# EAGLE design programmerRev2 (EAGLE 5.04)
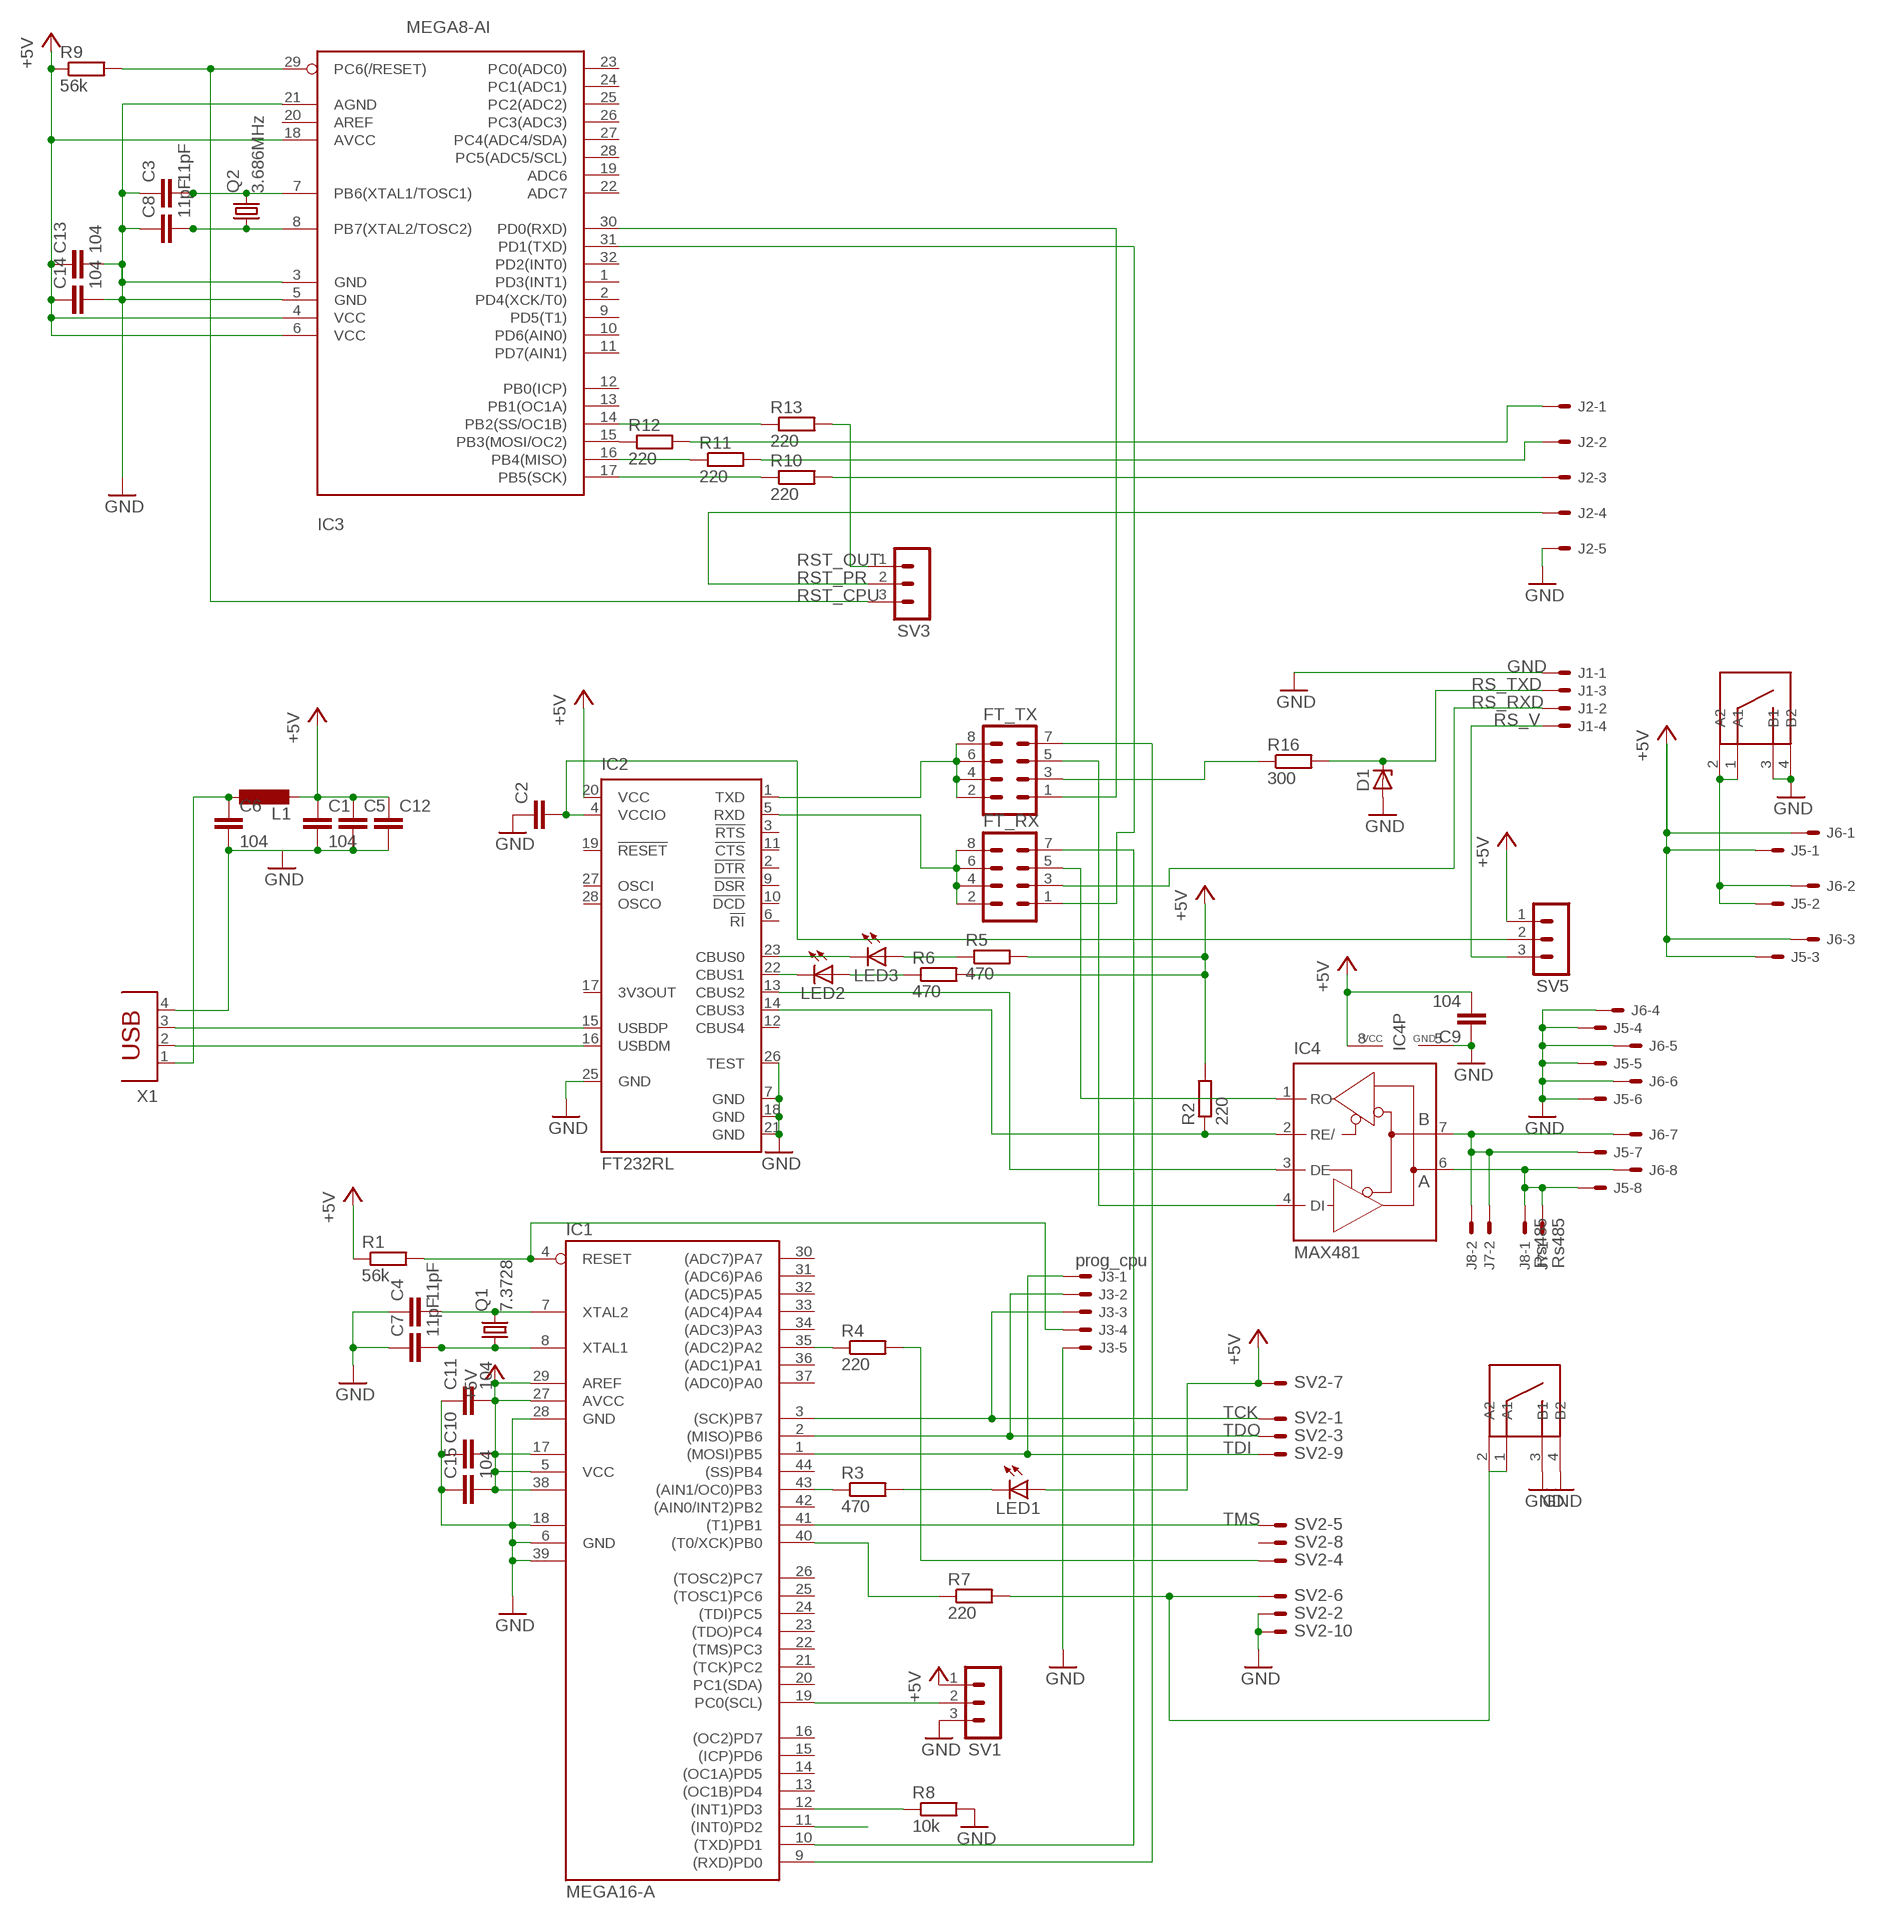
[diagram p0: schematic, sheet 1]

## Parts
C1  104  C-EUC1206  [C1206]
C2  C-EUC1206  [C1206]
C3  11pF  C-EUC1206  [C1206]
C4  11pF  C-EUC1206  [C1206]
C5  C-EUC1206  [C1206]
C6  104  C-EUC1206  [C1206]
C7  11pF  C-EUC1206  [C1206]
C8  11pF  C-EUC1206  [C1206]
C9  104  C-EUC1206  [C1206]
C10  C-EUC1206  [C1206]
C11  104  C-EUC1206  [C1206]
C12  C-EU025-050X050  [C025-050X050]
C13  104  C-EUC1206  [C1206]
C14  104  C-EUC1206  [C1206]
C15  104  C-EUC1206  [C1206]
D1  ZENER-DIODEZD-5  [ZDIO-5]
FT_RX  MA04-2  [MA04-2]
FT_TX  MA04-2  [MA04-2]
IC1  MEGA16-A  [TQFP44]
IC2  FT232RL  [SSOP28]
IC3  MEGA8-AI  [TQFP32-08]
IC4  MAX481  MAX481CSA  [SO08]
J1  22-05-7048-04  [7395-04]
J2  22-05-7058-05  [7395-05]
J3  prog_cpu  22-27-2051-05  [6410-05]
J5  22-05-7088-08  [7395-08]
J6  22-27-2081-08  [6410-08]
J7  Rs485  22-05-7028-02  [7395-02]
J8  Rs485  22-05-7028-02  [7395-02]
L1  L-EUL4532C  [L4532M]
LED1  LEDSMT1206  [1206]
LED2  LEDSMT1206  [1206]
LED3  LEDSMT1206  [1206]
Q1  7.3728  CRYTALHC49S  [HC49/S]
Q2  3.686MHz  CRYTALHC49S  [HC49/S]
R1  56k  R-EU_R1206  [R1206]
R2  220  R-EU_R1206  [R1206]
R3  470  R-EU_R1206  [R1206]
R4  220  R-EU_R1206  [R1206]
R5  470  R-EU_R1206  [R1206]
R6  470  R-EU_R1206  [R1206]
R7  220  R-EU_R1206  [R1206]
R8  10k  R-EU_R1206  [R1206]
R9  56k  R-EU_R1206  [R1206]
R10  220  R-EU_R1206  [R1206]
R11  220  R-EU_R1206  [R1206]
R12  220  R-EU_R1206  [R1206]
R13  220  R-EU_R1206  [R1206]
R16  300  R-EU_R1206  [R1206]
SV1  MA03-1  [MA03-1]
SV2  ML10E  [ML10]
SV3  MA03-1  [MA03-1]
SV5  MA03-1  [MA03-1]
U$1  KL2  [KL2]
U$2  KL2  [KL2]
X1  PN61729  [PN61729]

## Nets
+5V: C1.1 C5.1 C9.2 C10.2 C11.2 C12.1 C13.1 C14.1 C15.2 IC1.5(VCC) IC1.17(VCC1) IC1.27(AVCC) IC1.29(AREF) IC1.38(VCC2) IC2.20(VCC) IC3.4(VCC) IC3.6(VCC) IC3.18(AVCC) IC4.8(VCC) J5.1 J5.3 J6.1 J6.3 L1.2 LED1.A R1.1 R2.2 R5.2 R6.2 R9.1 SV1.1 SV2.7 SV5.1
FT232_V_IN: C2.2 IC2.4(VCCIO) SV5.2
GND: C1.2 C2.1 C3.1 C4.1 C5.2 C6.2 C7.1 C8.1 C9.1 C10.1 C11.1 C12.2 C13.2 C14.2 C15.1 D1.A IC1.6(GND) IC1.18(GND1) IC1.28(GND) IC1.39(GND2) IC2.7(GND) IC2.18(GND) IC2.21(GND) IC2.25(GND) IC2.26(TEST) IC3.3(GND) IC3.5(GND) IC3.21(AGND) IC4.5(GND) J1.1 J2.5 J3.5 J5.4 J5.5 J5.6 J6.4 J6.5 J6.6 R8.2 SV1.3 SV2.2 SV2.10 U$1.3(B1) U$1.4(B2) U$2.3(B1) U$2.4(B2) X1.4
N$1: C3.2 IC3.7(PB6(XTAL1/TOSC1)) Q2.2
N$2: C8.2 IC3.8(PB7(XTAL2/TOSC2)) Q2.1
N$3: FT_TX.3 R16.1
N$4: C6.1 L1.1 X1.1
N$5: C4.2 IC1.7(XTAL2) Q1.2
N$6: IC3.17(PB5(SCK)) R10.1
N$7: C7.2 IC1.8(XTAL1) Q1.1
N$8: IC1.4(RESET) J3.4 R1.2
N$9: FT_TX.7 IC1.9((RXD)PD0)
N$10: FT_RX.7 IC1.10((TXD)PD1)
N$11: R7.2 SV2.6 U$2.1(A1) U$2.2(A2)
N$12: IC1.19(PC0(SCL)) SV1.2
N$13: IC1.12((INT1)PD3) R8.1
N$14: IC4.6(A) J5.8 J6.8 J7.1 J8.1
N$15: IC4.7(B) J5.7 J6.7 J7.2 J8.2
N$16: IC2.14(CBUS3) IC4.2(RE/) R2.1
N$17: IC3.16(PB4(MISO)) R11.1
N$18: J5.2 J6.2 U$1.1(A1) U$1.2(A2)
N$19: FT_RX.5 IC4.1(RO)
N$20: FT_TX.5 IC4.4(DI)
N$21: IC3.15(PB3(MOSI/OC2)) R12.1
N$22: IC2.13(CBUS2) IC4.3(DE)
N$23: J2.3 R10.2
N$24: J2.2 R11.2
N$25: IC1.43((AIN1/OC0)PB3) R3.1
N$26: IC1.40((T0/XCK)PB0) R7.1
N$27: IC1.35((ADC2)PA2) R4.1
N$28: R4.2 SV2.4
N$29: LED1.C R3.2
N$30: J2.1 R12.2
N$31: IC3.14(PB2(SS/OC1B)) R13.1
N$32: LED3.A R5.1
N$33: LED2.A R6.1
N$34: IC2.22(CBUS1) LED2.C
N$35: IC2.23(CBUS0) LED3.C
N$36: IC1.11((INT0)PD2)
PROG_RXD: FT_RX.1 IC3.31(PD1(TXD))
PROG_TXD: FT_TX.1 IC3.30(PD0(RXD))
RS_RXD: FT_RX.3 J1.2
RS_TXD: D1.C J1.3 R16.2
RS_V: J1.4 SV5.3
RST_CPU: IC3.29(PC6(/RESET)) R9.2 SV3.3
RST_OUT: R13.2 SV3.1
RST_PR: J2.4 SV3.2
RXD: FT_RX.2 FT_RX.4 FT_RX.6 FT_RX.8 IC2.5(RXD)
TCK: IC1.3((SCK)PB7) J3.3 SV2.1
TDI: IC1.1((MOSI)PB5) J3.1 SV2.9
TDO: IC1.2((MISO)PB6) J3.2 SV2.3
TMS: IC1.41((T1)PB1) SV2.5
TXD: FT_TX.2 FT_TX.4 FT_TX.6 FT_TX.8 IC2.1(TXD)
USB+: IC2.15(USBDP) X1.3
USB-: IC2.16(USBDM) X1.2
Unconnected: IC1.13((OC1B)PD4) IC1.14((OC1A)PD5) IC1.15((ICP)PD6) IC1.16((OC2)PD7) IC1.20(PC1(SDA)) IC1.21((TCK)PC2) IC1.22((TMS)PC3) IC1.23((TDO)PC4) IC1.24((TDI)PC5) IC1.25((TOSC1)PC6) IC1.26((TOSC2)PC7) IC1.30((ADC7)PA7) IC1.31((ADC6)PA6) IC1.32((ADC5)PA5) IC1.33((ADC4)PA4) IC1.34((ADC3)PA3) IC1.36((ADC1)PA1) IC1.37((ADC0)PA0) IC1.42((AIN0/INT2)PB2) IC1.44((SS)PB4) IC2.2(!DTR) IC2.3(!RTS) IC2.6(!RI) IC2.9(!DSR) IC2.10(!DCD) IC2.11(!CTS) IC2.12(CBUS4) IC2.17(3V3OUT) IC2.19(!RESET) IC2.27(OSCI) IC2.28(OSCO) IC3.1(PD3(INT1)) IC3.2(PD4(XCK/T0)) IC3.9(PD5(T1)) IC3.10(PD6(AIN0)) IC3.11(PD7(AIN1)) IC3.12(PB0(ICP)) IC3.13(PB1(OC1A)) IC3.19(ADC6) IC3.20(AREF) IC3.22(ADC7) IC3.23(PC0(ADC0)) IC3.24(PC1(ADC1)) IC3.25(PC2(ADC2)) IC3.26(PC3(ADC3)) IC3.27(PC4(ADC4/SDA)) IC3.28(PC5(ADC5/SCL)) IC3.32(PD2(INT0)) SV2.8

## Library data of the parts
C1-C15 = rcl:C-EU: CAPACITOR, European symbol
D1 = diode:ZENER-DIODE: Z-Diode
FT_RX FT_TX = con-lstb:MA04-2: PIN HEADER
IC1 = atmel:MEGA16: MICROCONTROLLER 16 Kbytes FLASH 1 kbytes SRAM 512 bytes EEPROM USART 8-channel 10 bit ADC Source: avr.lbr
IC2 = ftdichip:FT232R: Source: http://www.ftdichip.com/Documents/DataSheets/DS_FT232R_v104.pdf
IC3 = atmel:MEGA8: MICROCONTROLLER 8 Kbytes FLASH 1 kbytes SRAM 512 bytes EEPROM USART 6-channel 10 bit ADC 2-channel 8 bit ADC Source: avr.lbr
IC4 = maxim:MAX481CSA: RS485 TRANSEIVER
J1 = con-molex:22-?-04: CONNECTOR wire to board 2.54 mm (.1 inch) pitch header
J2 J3 = con-molex:22-?-05: CONNECTOR wire to board 2.54 mm (.1 inch) pitch header
J5 J6 = con-molex:22-?-08: CONNECTOR wire to board 2.54 mm (.1 inch) pitch header
J7 J8 = con-molex:22-?-02: CONNECTOR wire to board 2.54 mm (.1 inch) pitch header
L1 = rcl:L-EU: INDUCTOR, European symbol
LED1-LED3 = led:LED: LED OSRAM: - CHIPLED LG R971, LG N971, LY N971, LG Q971, LY Q971, LO R971, LY R971 LH N974, LH R974 LS Q976, LO Q976, LY Q976 LO Q996 - Hyper CHIPLED LW Q18S LB Q993, LB Q99A, LB R99A - SideLED LS A670, LO A670, LY A670, LG A670, LP A670 LB A673, LV A673, LT A673, LW A673 LH A674 LY A675 LS A676, LA A676, LO A676, LY A676, LW A676 LS A679, LY A679, LG A679 - Hyper Micro SIDELED® LS Y876, LA Y876, LO Y876, LY Y876 LT Y87S - SmartLED LW L88C, LW L88S LB L89C, LB L89S, LG L890 LS L89K, LO L89K, LY L89K LS L896, LA L896, LO L896, LY L896 - TOPLED LS T670, LO T670, LY T670, LG T670, LP T670 LSG T670, LSP T670, LSY T670, LOP T670, LYG T670 LG T671, LOG T671, LSG T671 LB T673, LV T673, LT T673, LW T673 LH T674 LS T676, LA T676, LO T676, LY T676, LB T676, LH T676, LSB T676, LW T676 LB T67C, LV T67C, LT T67C, LS T67K, LO T67K, LY T67K, LW E67C LS E67B, LA E67B, LO E67B, LY E67B, LB E67C, LV E67C, LT E67C LW T67C LS T679, LY T679, LG T679 LS T770, LO T770, LY T770, LG T770, LP T770 LB T773, LV T773, LT T773, LW T773 LH T774 LS E675, LA E675, LY E675, LS T675 LS T776, LA T776, LO T776, LY T776, LB T776 LHGB T686 LT T68C, LB T68C - Hyper Mini TOPLED® LB M676 - Mini TOPLED Santana® LG M470 LS M47K, LO M47K, LY M47K Source: http://www.osram.convergy.de LUXEON: - LUMILED® LXK2-PW12-R00, LXK2-PW12-S00, LXK2-PW14-U00, LXK2-PW14-V00 LXK2-PM12-R00, LXK2-PM12-S00, LXK2-PM14-U00 LXK2-PE12-Q00, LXK2-PE12-R00, LXK2-PE12-S00, LXK2-PE14-T00, LXK2-PE14-U00 LXK2-PB12-K00, LXK2-PB12-L00, LXK2-PB12-M00, LXK2-PB14-N00, LXK2-PB14-P00, LXK2-PB14-Q00 LXK2-PR12-L00, LXK2-PR12-M00, LXK2-PR14-Q00, LXK2-PR14-R00 LXK2-PD12-Q00, LXK2-PD12-R00, LXK2-PD12-S00 LXK2-PH12-R00, LXK2-PH12-S00 LXK2-PL12-P00, LXK2-PL12-Q00, LXK2-PL12-R00 Source: www.luxeon.com KINGBRIGHT: KA-3528ASYC Source: www.kingbright.com
Q1 Q2 = crystal:CRYTAL: CRYSTAL
R1-R13 R16 = rcl:R-EU_: RESISTOR, European symbol
SV1 SV3 SV5 = con-lstb:MA03-1: PIN HEADER
SV2 = con-ml:ML10E: HARTING
U$1 U$2 = solarium:KL2
X1 = con-berg:PN61729: BERG USB connector

## Board
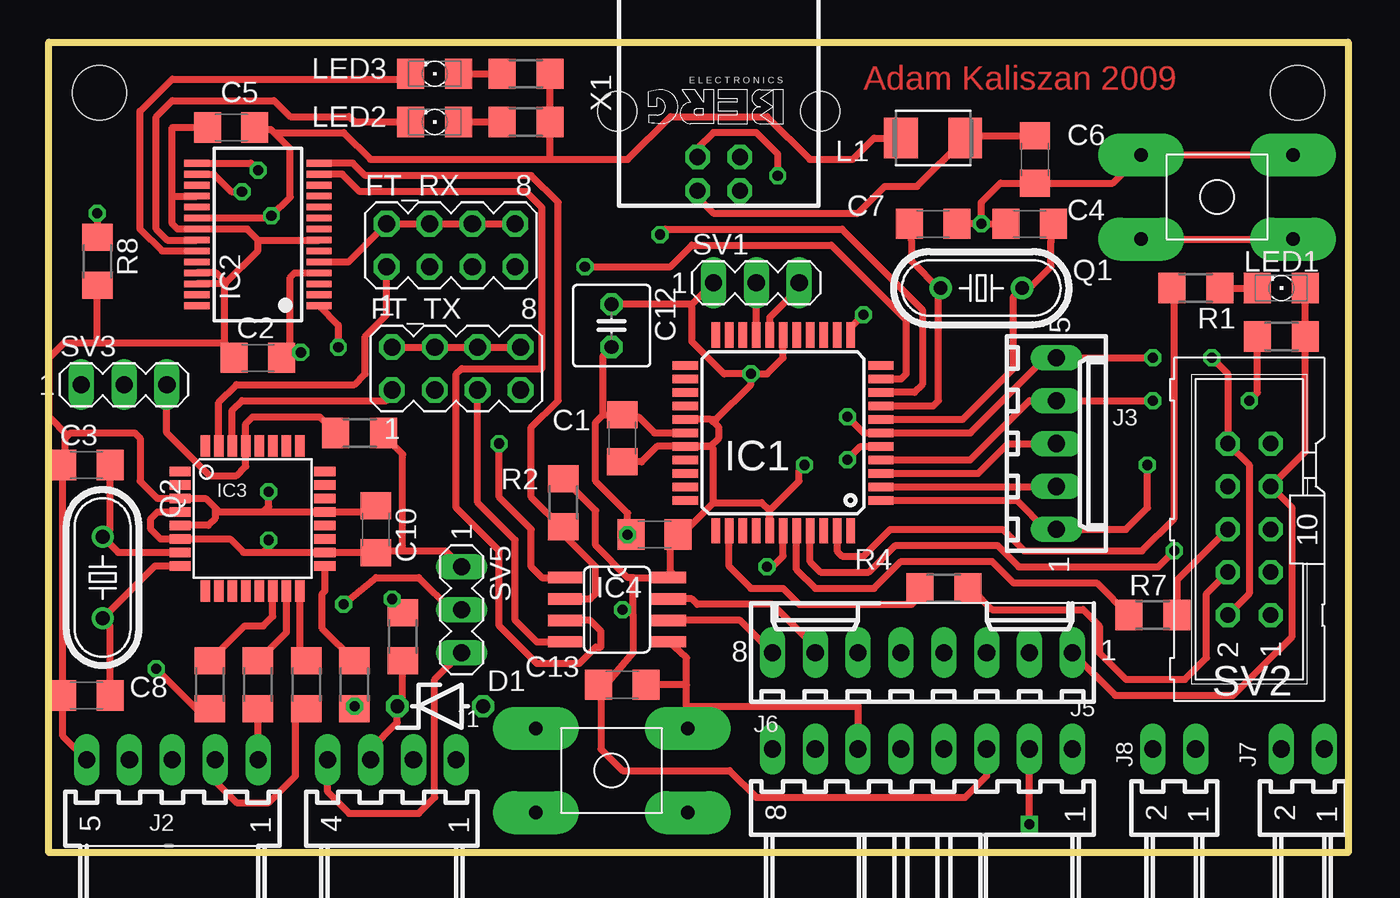
[diagram p1: board, top side]
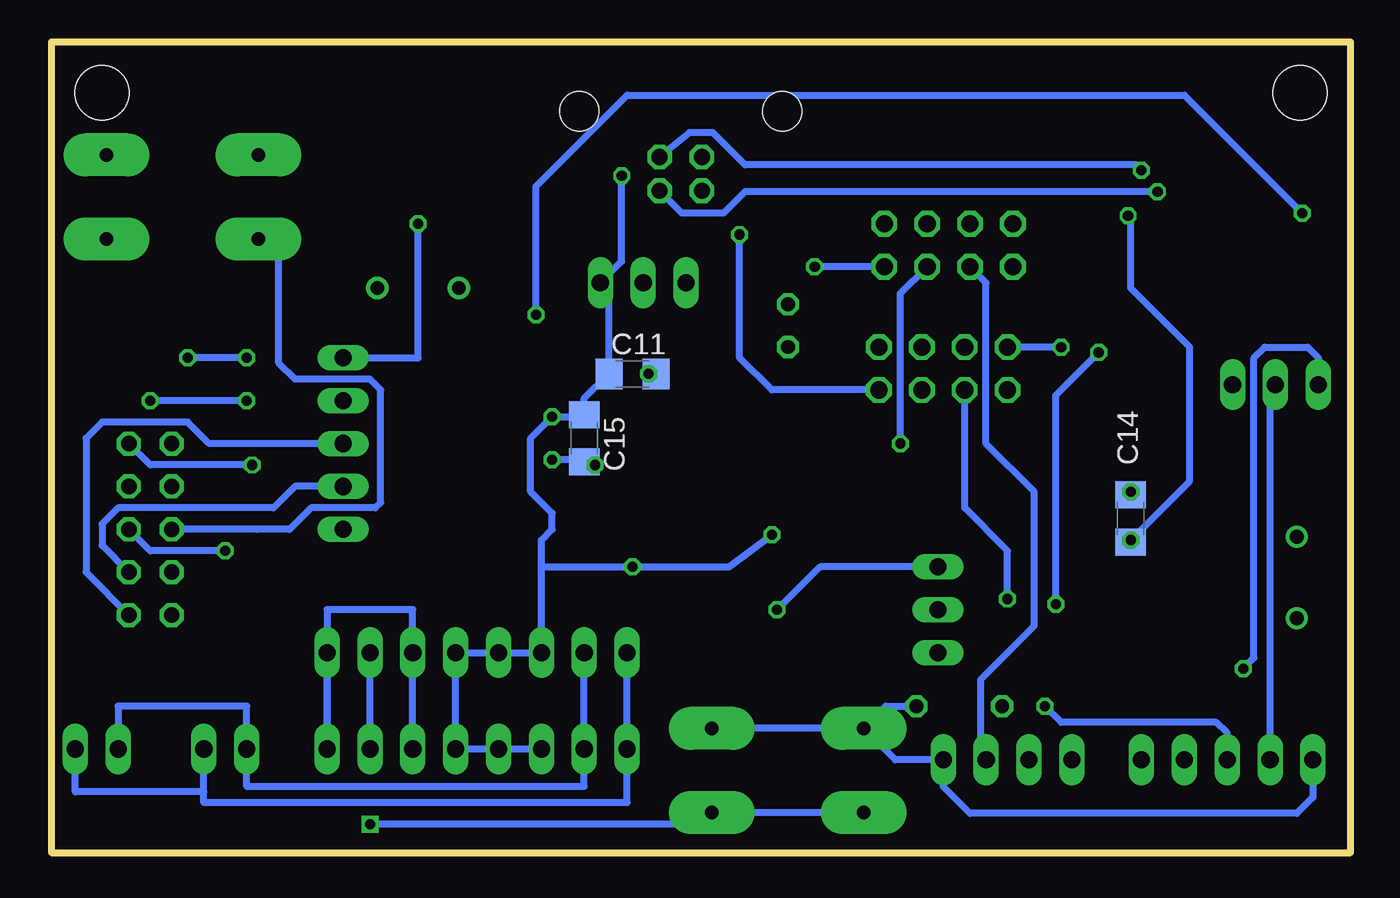
[diagram p2: board, bottom side, seen from below]

Size 77 x 48 mm. Coordinates in mm from the lower left corner, seen from the top.
Outline: 0,0 0,48 77,48 77,0 0,0
Copper layers (1*16): Top 0.035mm / dielectric 1.5mm / Bottom 0.035mm
Design rules "default": minimum track width 10mil, minimum drill 12mil, track to track 8mil, track to pad 8mil, pad to pad 8mil, via to via 8mil, smd to smd 0mil, copper to edge 0mil, drill to drill 8mil, minimum pad ring 10mil, minimum via ring 8mil, stop-mask expansion 4mil, vias tented up to drill 0mil, thermal gap 10mil
Holes 3.2 mm at 3,45 74,45

### Footprints (pad centres in the part's own frame; a part is rotated, then mirrored left to right if it is on the bottom)
C1206 = smd 1.6 x 1.8: 1 -1.4,0; 2 1.4,0
C025-050X050 = drill 0.813 octagon: 1 -1.27,0; 2 1.27,0
ZDIO-5 = drill 0.813 octagon: A 2.54,0; C -2.54,0
MA04-2 = drill 1.016 octagon: 1 -3.81,-1.27; 2 -3.81,1.27; 3 -1.27,-1.27; 4 -1.27,1.27; 5 1.27,-1.27; 6 1.27,1.27; 7 3.81,-1.27; 8 3.81,1.27
TQFP44 = smd 1.5 x 0.5: 1 -5.8,4; 2 -5.8,3.2; 3 -5.8,2.4; 4 -5.8,1.6; 5 -5.8,0.8; 6 -5.8,0; 7 -5.8,-0.8; 8 -5.8,-1.6; 9 -5.8,-2.4; 10 -5.8,-3.2; 11 -5.8,-4; 23 5.8,-4; 24 5.8,-3.2; 25 5.8,-2.4; 26 5.8,-1.6; 27 5.8,-0.8; 28 5.8,0; 29 5.8,0.8; 30 5.8,1.6; 31 5.8,2.4; 32 5.8,3.2; 33 5.8,4 | smd 0.5 x 1.5: 12 -4,-5.8; 13 -3.2,-5.8; 14 -2.4,-5.8; 15 -1.6,-5.8; 16 -0.8,-5.8; 17 0,-5.8; 18 0.8,-5.8; 19 1.6,-5.8; 20 2.4,-5.8; 21 3.2,-5.8; 22 4,-5.8; 34 4,5.8; 35 3.2,5.8; 36 2.4,5.8; 37 1.6,5.8; 38 0.8,5.8; 39 0,5.8; 40 -0.8,5.8; 41 -1.6,5.8; 42 -2.4,5.8; 43 -3.2,5.8; 44 -4,5.8
SSOP28 = smd 0.4 x 1.5: 1 -4.225,-3.625; 2 -3.575,-3.625; 3 -2.925,-3.625; 4 -2.275,-3.625; 5 -1.625,-3.625; 6 -0.975,-3.625; 7 -0.325,-3.625; 8 0.325,-3.625; 9 0.975,-3.625; 10 1.625,-3.625; 11 2.275,-3.625; 12 2.925,-3.625; 13 3.575,-3.625; 14 4.225,-3.625; 15 4.225,3.625; 16 3.575,3.625; 17 2.925,3.625; 18 2.275,3.625; 19 1.625,3.625; 20 0.975,3.625; 21 0.325,3.625; 22 -0.325,3.625; 23 -0.975,3.625; 24 -1.625,3.625; 25 -2.275,3.625; 26 -2.925,3.625; 27 -3.575,3.625; 28 -4.225,3.625
TQFP32-08 = smd 1.27 x 0.559: 1 -4.293,2.8; 2 -4.293,2; 3 -4.293,1.2; 4 -4.293,0.4; 5 -4.293,-0.4; 6 -4.293,-1.2; 7 -4.293,-2; 8 -4.293,-2.8; 17 4.293,-2.8; 18 4.293,-2; 19 4.293,-1.2; 20 4.293,-0.4; 21 4.293,0.4; 22 4.293,1.2; 23 4.293,2; 24 4.293,2.8 | smd 0.559 x 1.27: 9 -2.8,-4.293; 10 -2,-4.293; 11 -1.2,-4.293; 12 -0.4,-4.293; 13 0.4,-4.293; 14 1.2,-4.293; 15 2,-4.293; 16 2.8,-4.293; 25 2.8,4.293; 26 2,4.293; 27 1.2,4.293; 28 0.4,4.293; 29 -0.4,4.293; 30 -1.2,4.293; 31 -2,4.293; 32 -2.8,4.293
SO08 = smd 0.66 x 2.032: 1 -1.905,-3.073; 2 -0.635,-3.073; 3 0.635,-3.073; 4 1.905,-3.073; 5 1.905,3.073; 6 0.635,3.073; 7 -0.635,3.073; 8 -1.905,3.073
7395-04 = drill 1.016 long: 1 3.81,0; 2 1.27,0; 3 -1.27,0; 4 -3.81,0
7395-05 = drill 1.016 long: 1 5.08,0; 2 2.54,0; 3 0,0; 4 -2.54,0; 5 -5.08,0
6410-05 = drill 1.016 long: 1 5.08,0; 2 2.54,0; 3 0,0; 4 -2.54,0; 5 -5.08,0
7395-08 = drill 1.016 long: 1 8.89,0; 2 6.35,0; 3 3.81,0; 4 1.27,0; 5 -1.27,0; 6 -3.81,0; 7 -6.35,0; 8 -8.89,0
6410-08 = drill 1.016 long: 1 8.89,0; 2 6.35,0; 3 3.81,0; 4 1.27,0; 5 -1.27,0; 6 -3.81,0; 7 -6.35,0; 8 -8.89,0
7395-02 = drill 1.016 long: 1 1.27,0; 2 -1.27,0
L4532M = smd 2 x 2.4: 1 -1.9,0; 2 1.9,0
1206 = smd 1.6 x 1.803: A -1.422,0; C 1.422,0
HC49/S = drill 0.813 round: 1 -2.413,0; 2 2.413,0
R1206 = smd 1.6 x 1.803: 1 -1.422,0; 2 1.422,0
MA03-1 = drill 1.016 long: 1 -2.54,0; 2 0,0; 3 2.54,0
ML10 = drill 0.914 octagon: 1 -5.08,-1.27; 2 -5.08,1.27; 3 -2.54,-1.27; 4 -2.54,1.27; 5 0,-1.27; 6 0,1.27; 7 2.54,-1.27; 8 2.54,1.27; 9 5.08,-1.27; 10 5.08,1.27
KL2 = drill 0.8 pad 2.54 long: 1 -4.5,-2.5; 2 4.5,-2.5; 3 4.5,2.5; 4 -4.5,2.5
PN61729 = drill 0.95 octagon: 1 1.25,4.71; 2 -1.25,4.71; 3 -1.25,2.71; 4 1.25,2.71 | hole 2.3: -6.02,0; 6.02,0

### Placement (x,y rotation side)
C1  33.99,24.54 90 top
C2  12.4,29.3 0 top
C3  2.24,22.95 0 top
C4  58.12,37.24 0 top
C5  10.81,42.96 180 top
C6  58.44,41.05 270 top
C7  52.41,37.24 180 top
C8  2.24,9.3 0 top
C9  35.9,18.83 0 top
C10  19.38,19.14 270 top
C11  42.56,28.35 0 bottom
C12  33.35,31.21 270 top
C13  33.99,9.94 0 top
C14  13.04,19.78 90 bottom
C15  45.42,24.54 270 bottom
D1  23.2,8.67 0 top
FT_RX  23.83,35.97 0 top
FT_TX  24.15,28.67 0 top
IC1  43.52,24.86 180 top
IC2  12.4,36.61 90 top
IC3  12.08,19.78 0 top
IC4  33.67,14.38 270 top
J1  20.34,5.49 0 top
J2  7.32,5.49 0 top
J3  59.71,24.23 270 top
J5  51.77,6.13 0 top
J6  51.77,11.84 0 top
J7  74.31,6.13 0 top
J8  66.69,6.13 0 top
L1  52.41,42.32 180 top
LED1  73.04,33.43 180 top
LED2  22.88,43.27 180 top
LED3  22.88,46.13 180 top
Q1  55.26,33.43 0 top
Q2  3.19,16.29 90 top
R1  73.04,30.57 180 top
R2  30.5,20.73 90 top
R3  67.96,33.43 0 top
R4  53.04,15.65 0 top
R5  28.27,46.13 0 top
R6  28.27,43.27 0 top
R7  65.42,14.06 0 top
R8  2.88,35.02 270 top
R9  18.43,24.86 180 top
R10  18.11,9.94 270 top
R11  15.26,9.94 270 top
R12  12.4,9.94 270 top
R13  9.54,9.94 270 top
R16  20.97,12.79 270 top
SV1  41.93,33.75 0 top
SV2  71.14,19.14 90 top
SV3  4.46,27.72 0 top
SV5  24.47,14.38 270 top
U$1  33.35,4.86 0 top
U$2  69.23,38.83 0 top
X1  39.7,43.91 180 top

### Tracks (layer width: path | path; a pad name or v marks a point on that pad's centre or on a via)
+5V  (via drill 0.6)
  Top 0.406: 34.62,14.06 34.62,11.84 33.04,9.94 C13.1 32.72,9.81 32.72,6.13 33.99,4.86 40.34,4.86 41.93,3.27 54.31,3.27 55.58,4.54 J5.3 | 34.62,14.06 34.62,16.29 | 34.62,16.29 IC4.8 36.98,16.52 36.85,16.52 36.85,18.83 C9.2 37.48,18.83 39.39,20.73 | LED1.A R1.1 74.47,23.74 SV2.7 73.68,20.41 73.68,12.79 71.77,10.89 70.19,9.3 63.2,9.3 J6.1 | IC1.5 48.11,24.06 v47.33,23.27 | IC1.17 43.52,29.3 42.56,28.35 v41.61,28.35 | 39.39,20.73 42.24,20.73 42.72,20.26 IC1.38 42.72,20.25 44.47,22 44.47,22.64 v44.78,22.95 | 39.22,25.66 IC1.27 | 39.22,25.66 39.7,25.18 39.7,24.54 39.22,24.06 IC1.29 | IC1.29 39.23,24.06 39.39,23.91 39.39,20.73 | 39.22,25.66 39.55,25.66 41.61,27.72 v41.61,28.35 | C1.1 35.13,23.14 36.05,24.06 IC1.29 | IC3.4 6.45,20.18 6.05,19.78 6.05,19.14 6.61,18.58 IC3.6 10.74,18.58 11.54,17.78 12.72,17.78 | 12.72,17.78 IC3.18 19.35,17.78 C10.2 19.52,17.88 20.97,17.88 | 34.62,16.29 34.31,16.29 32.4,18.19 32.4,20.25 R2.2 | 38.12,32.48 SV1.1 | 38.12,32.48 38.12,30.26 40.02,28.35 C11.2 v41.61,28.35 | R9.1 19.85,24.71 20.97,23.59 20.97,17.88 | 20.97,17.88 23.51,17.88 SV5.1 | IC2.20 13.06,37.58 v13.19,37.72 14.3,38.83 14.3,41.69 13.35,42.64 | 13.35,42.64 13.16,42.83 12.08,42.83 C5.1 12.08,43.09 | v13.04,18.51 13.04,18.1 12.72,17.78 | v33.99,14.38 34.31,14.38 34.62,14.06 | L1.2 48.91,42.32 47.64,41.05 45.1,41.05 42.56,43.59 36.85,43.59 34.31,41.05 29.55,41.05 | 13.35,42.64 17.48,42.64 19.07,41.05 29.55,41.05 | 29.55,41.05 29.7,41.2 R6.2 R5.2 | 38.12,32.48 C12.1
  Bottom 0.406: J6.1 J5.1 60.66,14.38 55.58,14.38 J6.3 J5.3 | v47.33,23.27 45.55,23.27 C15.2 45.29,23.27 v44.78,22.95 | v41.61,28.35 C11.2 | v13.04,18.51 C14.1 | v13.04,18.51 13.04,18.83 | v13.04,18.51 9.54,22 9.54,29.94 13.04,33.43 13.04,37.56 v13.19,37.72 | SV5.1 31.45,16.92 v33.99,14.38
FT232_V_IN  (via drill 0.6)
  Top 0.406: SV5.2 23.83,14.38 21.92,16.29 19.38,16.29 v17.48,14.7 | v14.94,29.62 14.3,29.62 | 14.3,29.62 C2.2 | IC2.4 14.57,34.33 14.3,34.07 14.3,29.62
  Bottom 0.406: v17.48,14.7 17.48,27.08 v14.94,29.62
GND  (via drill 0.6)
  Top 0.406: IC4.5 37.8,11.53 37.8,9.94 | 37.8,9.94 37.8,7.36 U$1.3 37.85,8.67 47.96,8.67 J5.6 | 37.8,9.94 C13.2 | v55.26,37.24 C7.1 | IC1.18 42.72,31.68 44.15,33.11 44.15,33.43 SV1.3 | SV2.2 71.14,15.34 71.14,22.95 SV2.10 69.87,28.35 v68.92,29.3 | v65.42,29.3 J3.5 59.07,29.3 54.63,24.86 IC1.6 48.28,24.86 v47.33,25.81 | v55.26,37.24 C4.1 | IC1.39 43.52,17.56 42.88,16.92 v42.56,16.92 | C9.1 34.31,18.7 v34.31,18.83 34.31,20.1 32.4,22 32.4,25.5 32.85,25.94 | IC1.28 35.9,24.86 34.94,25.81 34.12,25.81 C1.2 32.85,25.94 | J2.5 0.84,6.89 C8.1 C3.1 0.97,23.09 0.97,24.54 1.13,24.7 | IC3.5 9.46,19.38 9.86,19.78 9.86,20.41 | 9.86,20.41 9.3,20.98 IC3.3 6.44,20.98 5.41,22 5.41,24.54 5.1,24.86 1.29,24.86 1.13,24.7 | 12.72,20.18 10.09,20.18 9.86,20.41 | 12.72,20.18 IC3.21 19.02,20.18 C10.1 | 12.41,36.28 IC2.7 | 12.41,36.28 11.77,36.92 9.23,36.92 9.22,36.93 IC2.21 7.63,36.93 7.32,37.24 7.32,39 | 10.43,33.68 10.5,33.75 9.91,34.33 IC2.25 | 10.43,33.68 IC2.26 | 10.43,33.68 12.4,35.66 12.4,36.27 12.41,36.28 | 10.43,30.2 10.43,33.68 | 10.43,30.2 C2.1 | v13.04,21.37 13.04,20.5 12.72,20.18 | 2.88,30.2 0.91,30.2 0.02,29.3 0.02,25.81 1.13,24.7 | 2.88,30.2 10.43,30.2 | C5.2 7.32,42.96 7.32,39 | v55.26,37.24 55.26,38.51 56.4,39.65 C6.2 63.06,39.65 U$2.4 U$2.3 | X1.4 38.45,41.71 39.39,42.64 41.93,42.64 43.2,41.37 v43.2,40.1 | 32.85,25.94 32.85,29.43 C12.2 | IC2.18 7.44,38.88 7.32,39 | 2.88,30.2 R8.2
  Bottom 0.406: J5.6 J5.5 J5.4 J6.4 J6.5 J6.6 47.96,16.92 | U$1.4 U$1.3 | v65.42,29.3 v68.92,29.3 | v55.26,37.24 55.26,29.3 J3.5 | v34.31,18.83 36.85,16.92 v42.56,16.92 47.96,16.92 | 47.96,16.92 47.96,18.51 47.33,19.14 47.33,20.1 48.59,21.37 48.59,24.54 v47.33,25.81 45.55,25.81 C15.1 45.42,26.89 C11.1 43.96,33.25 SV1.3 43.2,35.02 v43.2,40.1 | U$1.4 26.99,5.49 J1.1 24.15,3.91 22.56,2.32 3.19,2.32 2.24,3.27 J2.5 | D1.A 27.55,8.67 U$1.4 | v13.04,21.37 C14.2
N$1
  Top 0.406: C3.2 3.64,19.15 Q2.2 4.11,17.78 IC3.7
N$2
  Top 0.406: C8.2 3.64,13.43 Q2.1 6.3,16.98 IC3.8
N$3  (via drill 0.6)
  Top 0.406: R16.1 20.97,14.38 v20.34,15.02
  Bottom 0.406: v20.34,15.02 20.34,17.88 22.88,20.41 FT_TX.3
N$4
  Top 0.406: C6.1 54.44,42.45 L1.1 51.45,39.47 49.55,39.47 47.96,37.88 39.39,37.88 38.45,38.81 X1.1
N$5
  Top 0.406: C4.2 59.39,36.16 59.39,34.7 57.8,33.11 Q1.2 57.17,32.92 57.17,28.67 54.16,25.66 IC1.7
N$6
  Top 0.406: IC3.17 16.38,15.5 16.21,15.34 16.21,13.26 R10.1
N$7
  Top 0.406: C7.2 51.14,36.16 51.14,35.02 52.85,33.3 Q1.1 52.72,33.3 52.72,26.77 52.42,26.46 IC1.8
N$8  (via drill 0.6)
  Top 0.406: IC1.4 54.61,23.26 58.12,26.77 J3.4 v65.42,26.77 | R1.2 71.62,27.25 v71.14,26.77
  Bottom 0.406: v65.42,26.77 v71.14,26.77
N$9  (via drill 0.6)
  Top 0.406: IC1.9 51.31,27.26 51.77,27.72 51.77,32.16 47.01,36.92 36.53,36.92 v36.21,36.61
  Bottom 0.406: FT_TX.7 34.31,27.4 36.21,29.3 v36.21,36.61
N$10  (via drill 0.6)
  Top 0.406: IC1.10 50.52,28.06 50.82,28.35 50.82,31.53 46.37,35.97 38.12,35.97 36.85,34.7 v31.77,34.7
  Bottom 0.406: FT_RX.7 v31.77,34.7
N$11
  Top 0.406: U$2.1 U$2.2 | R7.2 66.84,16.12 SV2.6
  Bottom 0.406: SV2.6 64.79,19.14 62.88,19.14 61.61,20.41 57.8,20.41 57.48,20.73 57.48,27.4 58.12,28.04 62.56,28.04 63.52,28.99 63.52,35.12 U$2.1
N$12
  Top 0.406: SV1.2 41.93,30.67 IC1.19
N$13  (via drill 0.6)
  Top 0.406: IC1.12 47.52,31.08 v48.28,31.84 | v2.88,37.88 R8.1
  Bottom 0.406: v48.28,31.84 48.28,39.47 42.88,44.86 9.86,44.86 v2.88,37.88
N$14
  Top 0.406: IC4.6 40.98,13.75 J6.8
  Bottom 0.406: J7.1 75.58,3.59 67.96,3.59 | 67.96,3.59 J8.1 | 67.96,3.59 67.96,2.95 42.88,2.95 J5.8 J6.8
N$15
  Top 0.406: IC4.7 38.12,15.02 38.44,14.7 42.88,14.7 45.42,12.16 J6.7
  Bottom 0.406: J7.2 73.04,8.67 65.42,8.67 J8.2 65.42,3.91 45.42,3.91 J5.7 J6.7
N$16
  Top 0.406: IC4.2 32.09,15.02 32.4,15.34 32.4,16.92 30.5,18.83 30.35,19.46 R2.1 30.03,18.83 30.5,19.14 28.59,21.05 28.59,25.18 30.18,26.77 30.18,38.51 28.59,40.1 18.75,40.1 18.02,40.83 IC2.14
N$17
  Top 0.406: IC3.16 14.88,11.73 R11.1
N$18  (via drill 0.6)
  Top 0.406: v58.12,1.68 J5.2
  Bottom 0.406: J5.2 J6.2 | v58.12,1.68 37.85,1.68 U$1.2 U$1.1
N$19  (via drill 0.6)
  Top 0.406: IC4.1 29.23,16.29 28.59,16.92 28.59,19.14 26.69,21.05 v26.69,24.23
  Bottom 0.406: v26.69,24.23 26.69,33.11 FT_RX.5
N$20
  Top 0.406: IC4.4 28.91,12.48 27.64,13.75 27.64,18.51 25.42,20.73 FT_TX.5
N$21
  Top 0.406: IC3.15 14.08,13.04 R12.1
N$22
  Top 0.406: IC2.13 17.4,40.18 18.43,39.15 28.27,39.15 29.23,38.2 29.23,28.67 24.47,28.67 24.15,28.35 24.15,20.41 26.69,17.88 26.69,13.43 28.91,11.21 31.45,11.21 32.4,12.16 32.72,12.16 32.72,13.11 32.09,13.75 IC4.3
N$23  (via drill 0.6)
  Top 0.406: v18.11,8.67 R10.2
  Bottom 0.406: J2.3 7.32,7.08 7.95,7.71 17.16,7.71 v18.11,8.67
N$24
  Top 0.406: J2.2 9.86,4.22 11.13,2.95 13.04,2.95 14.62,4.54 14.62,8.52 R11.2
N$25
  Top 0.406: IC1.43 46.72,17.85 47.01,17.56 48.28,17.56 49.87,19.14 56.53,19.14 57.8,17.88 64.79,17.88 66.69,19.78 66.69,32.64 R3.1
N$26
  Top 0.406: IC1.40 44.31,16.76 45.42,15.65 48.91,15.65 50.5,17.24 55.9,17.24 57.17,15.97 62.1,15.97 R7.1
N$27
  Top 0.406: 51.77,15.65 R4.1 52.09,15.65 51.14,14.7 44.47,14.7 43.52,15.65 41.61,15.65 40.31,16.95 IC1.35
N$28
  Top 0.406: R4.2 54.78,15.5 55.9,14.38 61.3,14.38 62.25,13.43 62.25,11.84 63.83,10.26 67.33,10.26 68.6,11.53 68.6,15.34 SV2.4
N$29
  Top 0.406: R3.2 LED1.C
N$30
  Top 0.406: J2.1 R12.2
N$31
  Top 0.406: IC3.14 13.28,13.99 12.72,13.43 11.61,13.43 R13.1
N$32
  Top 0.406: LED3.A R5.1
N$33
  Top 0.406: LED2.A R6.1
N$34
  Top 0.406: IC2.22 7.01,36.28 6.37,36.92 6.37,43.59 7.32,44.55 13.35,44.55 14.3,43.59 17.8,43.59 18.11,43.27 LED2.C
N$35
  Top 0.406: IC2.23 6.71,35.63 5.41,36.92 5.41,43.91 7.32,45.81 21.14,45.81 LED3.C
PROG_RXD
  Top 0.406: FT_RX.1 20.02,31.84 18.75,30.57 18.75,28.35 18.11,27.72 11.13,27.72 10.08,26.67 IC3.31
PROG_TXD
  Top 0.406: FT_TX.1 20.34,27.08 20.02,26.77 11.45,26.77 10.88,26.2 IC3.30
RS_RXD
  Bottom 0.406: J1.2 21.92,5.81 21.92,10.26 18.75,13.43 18.75,21.37 21.61,24.23 21.61,33.75 FT_RX.3
RS_TXD
  Top 0.406: J1.3 19.07,6.13 20.66,7.71 D1.C 20.97,8.98 R16.2
RS_V
  Top 0.406: J1.4 16.53,3.59 17.8,2.32 21.92,2.32 22.88,3.27 22.88,10.26 SV5.3
RST_CPU
  Top 0.406: SV3.3 7,24.86 9.54,22.32 11.13,22.32 11.68,22.87 IC3.29 11.68,25.41 12.08,25.81 16.06,25.81 R9.2
RST_OUT  (via drill 0.6)
  Top 0.406: R13.2 8.74,8.52 v6.37,10.89
  Bottom 0.406: v6.37,10.89 5.73,11.53 5.73,29.3 5.1,29.94 2.56,29.94 1.92,29.3 SV3.1
RST_PR
  Bottom 0.406: J2.4 4.78,27.4 SV3.2
RXD
  Top 0.406: FT_RX.8 FT_RX.6 FT_RX.4 FT_RX.2 17.76,34.98 IC2.5
TCK
  Top 0.406: IC1.3 55.08,22.46 56.85,24.23 J3.3
  Bottom 0.406: J3.3 67.64,24.23 68.92,25.5 74,25.5 74.95,24.54 74.95,16.61 SV2.1
TDI  (via drill 0.6)
  Top 0.406: IC1.1 57.36,20.86 59.07,19.14 J3.1 63.83,19.14 65.11,20.41 v65.11,22.95
  Bottom 0.406: v65.11,22.95 71.14,22.95 SV2.9
TDO
  Top 0.406: IC1.2 59.68,21.66 J3.2
  Bottom 0.406: J3.2 62.56,21.68 63.83,20.41 73.04,20.41 74,19.46 74,18.19 SV2.3
TMS  (via drill 0.6)
  Top 0.406: IC1.41 45.12,17.23 45.74,16.61 48.59,16.61 50.18,18.19 56.22,18.19 57.48,16.92 65.74,16.92 v66.69,17.88
  Bottom 0.406: v66.69,17.88 71.14,17.88 SV2.5
TXD  (via drill 0.6)
  Top 0.406: FT_TX.8 FT_TX.6 FT_TX.4 FT_TX.2 | v17.16,29.94 17.16,31.25 IC2.1
  Bottom 0.406: v17.16,29.94 FT_TX.2
USB+  (via drill 0.6)
  Top 0.406: IC2.15 11.98,40.83 v12.4,40.42
  Bottom 0.406: v12.4,40.42 12.72,40.73 35.9,40.73 37.8,42.64 39.2,42.64 X1.3
USB-  (via drill 0.6)
  Top 0.406: IC2.16 9.78,40.18 10.81,39.15 v11.45,39.15
  Bottom 0.406: v11.45,39.15 35.9,39.15 37.16,37.88 39.63,37.88 X1.2

### Text on the board
Top: Adam Kaliszan 2009
Document: USB Con | Main contr. | reset | programmer | mode | Bootloader SW | USB | conv. | PE SW | Atmega | 16 | Atmega | Temp. | STK500 | 8 | JTAG Con | RS 3.3V SW | Execution | module | reset | Main Module Con | 2X RS 485 | STK 500 | Rs232 TTL